# Altium schematic sheet Remote_Control.SchDoc
size A3; CheckedBy: <审核日期>; Author: llm; CompanyName: 孔乙己图书店; DocumentNumber: 1; SheetNumber: 1; SheetTotal: 1; PageSetup: Record=PageOptions|CenterHorizontal=True|CenterVertical=True|PrintScale=1.00|XCorrection=1.00|YCorrection=1.00|PrintKind=0|BorderSize=5000000|LeftOffset=0|BottomOffset=0|Orientation=2|PaperLength=1000|PaperWidth=1000|Scale=100|PaperSource=7|PrintQuality=600|MediaType=1|DitherType=10|PaperKind=A4|PrintScaleMode=1; DesignDate: <设计日期>; CheckDate: <审核人员>; SheetName: Remote_Control; SheetVersion: Rev.A; SheetDescription: <图纸描述>; productName: 遥控器
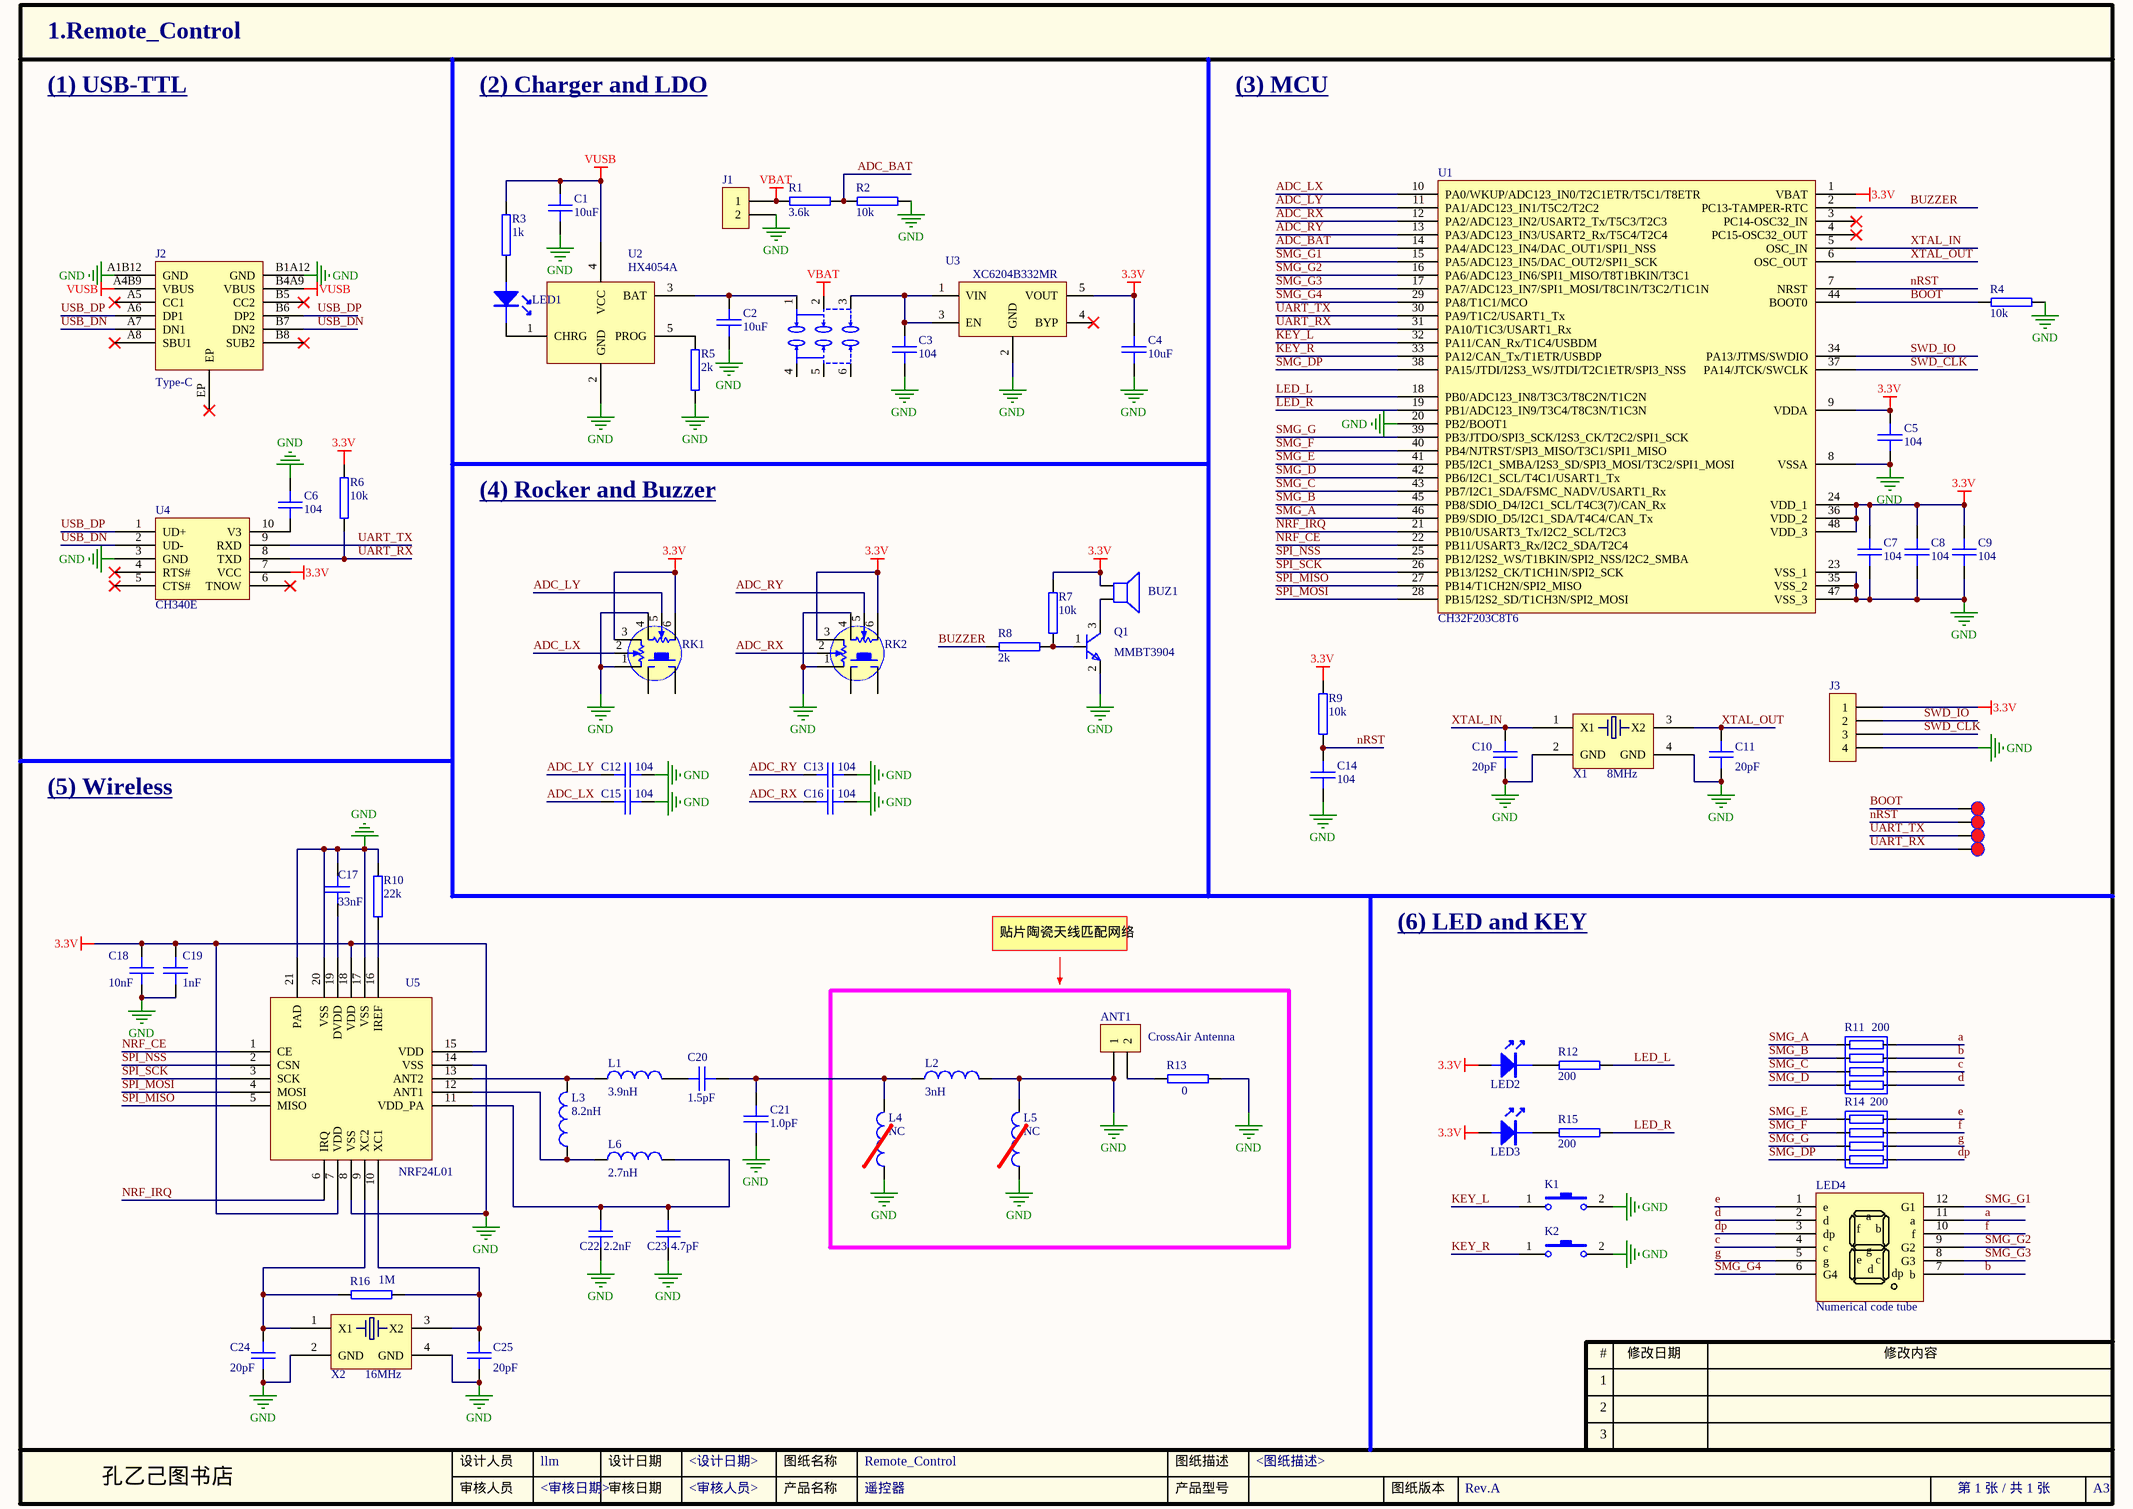
[diagram p0: Remote_Control.SchDoc]

## Parts
ANT1  CrossAir Antenna  [ANT-SMD_L3.1-W1.6]
BOOT  BOOT  [PAD-40]  (value not drawn)  (no BOM)
BUZ1  BUZZER  [BUZ-TH_BD9.6-P5.00-D0.7-FD]  (value not drawn)
C1  10uF  [0805C]
C2  10uF  [0805C]
C3  104  [0402C]
C4  10uF  [0805C]
C5  104  [0402C]
C6  104  [0402C]
C7  104  [0402C]
C8  104  [0402C]
C9  104  [0402C]
C10  20pF  [0402C]
C11  20pF  [0402C]
C12  104  [0402C]
C13  104  [0402C]
C14  104  [0402C]
C15  104  [0402C]
C16  104  [0402C]
C17  33nF  [0402C]
C18  10nF  [0402C]
C19  1nF  [0402C]
C20  1.5pF  [0402C]
C21  1.0pF  [0402C]
C22  2.2nF  [0402C]
C23  4.7pF  [0402C]
C24  20pF  [0402C]
C25  20pF  [0402C]
J1  CON2  [SIP-2-2.54]  (value not drawn)
J2  Type-C  [USB-C-SMD_TYPE-C-16P-1]
J3  CON4  [SIP-4-2.54]  (value not drawn)
K1  BUTTON  [KEY-TH_4P-L7.5-W6.8-P4.50-LS7.2]  (value not drawn)
K2  BUTTON  [KEY-TH_4P-L7.5-W6.8-P4.50-LS7.2]  (value not drawn)
L1  3.9nH  [0402R]
L2  3nH  [0402R]
L3  8.2nH  [0402R]
L4  NC  [0402R]
L5  NC  [0402R]
L6  2.7nH  [0402R]
LED1  Red  [LED-0603]  (value not drawn)
LED2  Blue  [LED-0603]  (value not drawn)
LED3  Blue  [LED-0603]  (value not drawn)
LED4  Numerical code tube  [0.28寸四位共阴数码管]
Q1  MMBT3904  [SOT-23]
R1  3.6k  [0402R]
R2  10k  [0402R]
R3  1k  [0402R]
R4  10k  [0402R]
R5  2k  [0402R]
R6  10k  [0402R]
R7  10k  [0402R]
R8  2k  [0402R]
R9  10k  [0402R]
R10  22k  [0402R]
R11  200  [RES-0603-8P]
R12  200  [0402R]
R13  0  [0402R]
R14  200  [RES-0603-8P]
R15  200  [0402R]
R16  1M  [0402R]
RK1  ROCKER  [ROCKER]  (value not drawn)
RK2  ROCKER  [ROCKER]  (value not drawn)
RST  RST  [PAD-40]  (value not drawn)  (no BOM)
Rx  Rx  [PAD-40]  (value not drawn)  (no BOM)
SW1  MST22D18G2  [SW-SMD_MST22D18G2]  (value not drawn)
Tx  Tx  [PAD-40]  (value not drawn)  (no BOM)
U1  CH32F203C8T6  [LQFP-48_7x7]
U2  HX4054A  [SOT-23-5_L3.0-W1.7-P0.95-LS2.8-BR]
U3  XC6204B332MR  [SOT-23-5]
U4  CH340E  [MSOP-10_L3.0-W3.0-P0.50-LS5.0-BL]
U5  NRF24L01  [QFN-20_L4.0-W4.0-P0.50-BL-EP]
X1  8MHz  [OSCCC250X320X80-4N]
X2  16MHz  [OSCCC250X320X80-4N]

## Nets
3.3V: BUZ1.1(+) C4.1 C5.2 C7.2 C8.2 C9.2 C18.1 C19.1 J3.1 LED2.1 LED3.1 R6.2 R7.2 R9.2 RK1.3 RK1.6 RK2.3 RK2.6 U1.1(VBAT) U1.9(VDDA) U1.24(VDD_1) U1.36(VDD_2) U1.48(VDD_3) U3.5(VOUT) U4.7(VCC) U5.7(VDD) U5.15(VDD) U5.18(VDD)
GND: ANT1.1 C1.2 C2.2 C3.2 C4.2 C5.1 C6.2 C7.1 C8.1 C9.1 C10.1 C11.1 C12.1 C13.1 C14.1 C15.1 C16.1 C17.1 C18.2 C19.2 C21.1 C22.2 C23.2 C24.1 C25.1 J1.2 J2.A1B12(GND) J2.B1A12(GND) J3.4 K1.2 K2.2 L2.2 L4.1 L5.1 L5.2 Q1.2(E) R2.1 R4.2 R5.1 R10.1 R13.2 RK1.1 RK1.4 RK2.1 RK2.4 U1.8(VSSA) U1.20(PB2/BOOT1) U1.23(VSS_1) U1.35(VSS_2) U1.47(VSS_3) U2.2(GND) U3.2(GND) U4.3(GND) U5.8(VSS) U5.14(VSS) U5.17(VSS) U5.20(VSS) U5.21(PAD) X1.2(GND) X1.4(GND) X2.2(GND) X2.4(GND)
VBAT: J1.1 R1.2 SW1.2
VUSB: C1.1 J2.A4B9(VBUS) J2.B4A9(VBUS) R3.2 U2.4(VCC)
a: LED4.11(a) R11.4
ADC_BAT: R1.1 R2.2 U1.14(PA4/ADC123_IN4/DAC_OUT1/SPI1_NSS)
ADC_LX: C15.2 RK1.2 U1.10(PA0/WKUP/ADC123_IN0/T2C1ETR/T5C1/T8ETR)
ADC_LY: C12.2 RK1.5 U1.11(PA1/ADC123_IN1/T5C2/T2C2)
ADC_RX: C16.2 RK2.2 U1.12(PA2/ADC123_IN2/USART2_Tx/T5C3/T2C3)
ADC_RY: C13.2 RK2.5 U1.13(PA3/ADC123_IN3/USART2_Rx/T5C4/T2C4)
b: LED4.7(b) R11.3
BOOT: BOOT.1 R4.1 U1.44(BOOT0)
BUZZER: R8.2 U1.2(PC13-TAMPER-RTC)
c: LED4.4(c) R11.2
d: LED4.2(d) R11.1
dp: LED4.3(dp) R14.1
e: LED4.1(e) R14.4
f: LED4.10(f) R14.3
g: LED4.5(g) R14.2
KEY_L: K1.1 U1.32(PA11/CAN_Rx/T1C4/USBDM)
KEY_R: K2.1 U1.33(PA12/CAN_Tx/T1ETR/USBDP)
LED_L: R12.1 U1.18(PB0/ADC123_IN8/T3C3/T8C2N/T1C2N)
LED_R: R15.1 U1.19(PB1/ADC123_IN9/T3C4/T8C3N/T1C3N)
NRF_CE: U1.22(PB11/USART3_Rx/I2C2_SDA/T2C4) U5.1(CE)
NRF_IRQ: U1.21(PB10/USART3_Tx/I2C2_SCL/T2C3) U5.6(IRQ)
nRST: C14.2 R9.1 RST.1 U1.7(NRST)
SMG_A: R11.5 U1.46(PB9/SDIO_D5/I2C1_SDA/T4C4/CAN_Tx)
SMG_B: R11.6 U1.45(PB8/SDIO_D4/I2C1_SCL/T4C3(7)/CAN_Rx)
SMG_C: R11.7 U1.43(PB7/I2C1_SDA/FSMC_NADV/USART1_Rx)
SMG_D: R11.8 U1.42(PB6/I2C1_SCL/T4C1/USART1_Tx)
SMG_DP: R14.8 U1.38(PA15/JTDI/I2S3_WS/JTDI/T2C1ETR/SPI3_NSS)
SMG_E: R14.5 U1.41(PB5/I2C1_SMBA/I2S3_SD/SPI3_MOSI/T3C2/SPI1_MOSI)
SMG_F: R14.6 U1.40(PB4/NJTRST/SPI3_MISO/T3C1/SPI1_MISO)
SMG_G: R14.7 U1.39(PB3/JTDO/SPI3_SCK/I2S3_CK/T2C2/SPI1_SCK)
SMG_G1: LED4.12(G1) U1.15(PA5/ADC123_IN5/DAC_OUT2/SPI1_SCK)
SMG_G2: LED4.9(G2) U1.16(PA6/ADC123_IN6/SPI1_MISO/T8T1BKIN/T3C1)
SMG_G3: LED4.8(G3) U1.17(PA7/ADC123_IN7/SPI1_MOSI/T8C1N/T3C2/T1C1N)
SMG_G4: LED4.6(G4) U1.29(PA8/T1C1/MCO)
SPI_MISO: U1.27(PB14/T1CH2N/SPI2_MISO) U5.5(MISO)
SPI_MOSI: U1.28(PB15/I2S2_SD/T1CH3N/SPI2_MOSI) U5.4(MOSI)
SPI_NSS: U1.25(PB12/I2S2_WS/T1BKIN/SPI2_NSS/I2C2_SMBA) U5.2(CSN)
SPI_SCK: U1.26(PB13/I2S2_CK/T1CH1N/SPI2_SCK) U5.3(SCK)
SWD_CLK: J3.3 U1.37(PA14/JTCK/SWCLK)
SWD_IO: J3.2 U1.34(PA13/JTMS/SWDIO)
UART_RX: R6.1 Rx.1 U1.31(PA10/T1C3/USART1_Rx) U4.8(TXD)
UART_TX: Tx.1 U1.30(PA9/T1C2/USART1_Tx) U4.9(RXD)
USB_DN: J2.A7(DN1) J2.B7(DN2) U4.2(UD-)
USB_DP: J2.A6(DP1) J2.B6(DP2) U4.1(UD+)
XTAL_IN: C10.2 U1.5(OSC_IN) X1.1(X1)
XTAL_OUT: C11.2 U1.6(OSC_OUT) X1.3(X2)
NetANT1_2: ANT1.2 R13.1
NetBUZ1_2: BUZ1.2(-) Q1.3(C)
NetC2_1: C2.1 SW1.1 U2.3(BAT)
NetC3_1: C3.1 SW1.3 U3.1(VIN) U3.3(EN)
NetC6_1: C6.1 U4.10(V3)
NetC17_2: C17.2 U5.19(DVDD)
NetC20_1: C20.1 L1.2
NetC20_2: C20.2 C21.2 L2.1 L4.2
NetC22_1: C22.1 C23.1 L6.2 U5.11(VDD_PA)
NetC24_2: C24.2 R16.1 U5.9(XC2) X2.1(X1)
NetC25_2: C25.2 R16.2 U5.10(XC1) X2.3(X2)
NetL1_1: L1.1 L3.2 U5.13(ANT2)
NetL3_1: L3.1 L6.1 U5.12(ANT1)
NetLED1_1: LED1.1 R3.1
NetLED1_2: LED1.2 U2.1(CHRG)
NetLED2_2: LED2.2 R12.2
NetLED3_2: LED3.2 R15.2
NetQ1_1: Q1.1(B) R7.1 R8.1
NetR5_2: R5.2 U2.5(PROG)
NetR10_2: R10.2 U5.16(IREF)

Not connected (* = marked no-connect by the designer): J2 A5(CC1)* A8(SBU1)* B5(CC2)* B8(SUB2)* EP*; RK1 J1 J2; RK2 J1 J2; SW1 4 5 6; U1 3(PC14-OSC32_IN)* 4(PC15-OSC32_OUT)*; U3 4(BYP)*; U4 4(RTS#)* 5(CTS#)* 6(TNOW)*

## Notes on the sheet
- (1) USB-TTL
- (2) Charger and LDO
- (3) MCU
- (4) Rocker and Buzzer
- (5) Wireless
- 贴片陶瓷天线匹配网络
- (6) LED and KEY
- 1
- #
- 修改日期
- 修改内容
- 2
- 3
- 设计人员
- 审核人员
- 设计日期
- 审核日期
- 产品名称
- 图纸名称
- 产品型号
- 图纸描述
- 图纸版本
- A3

## Library data of the parts
ANT1 J1 = CON2: Connector
BOOT RST Rx Tx = TEST-DOT: 测试点
BUZ1 = BUZZER: 蜂鸣器
C1-C25 = CAP: 电容
J3 = CON4: Connector
K1 K2 = BUTTON: 按键开关
L1-L6 = INDUCTOR_1: 电感
LED1-LED3 = LED: 发光二极管; Value: 0603Red,SMD
LED4 = Numerical code tube: 四位共阴数码管
Q1 = NPN: NPN三极管
R1-R10 R12 R13 R15 R16 = RES: 电阻
R11 R14 = RES_4: 排阻
RK1 RK2 = ROCKER: 摇杆电位器
SW1 = MST22D18G2: 六脚拨动开关; Manufacturer: SHOU HAN(首韩); Add into BOM: yes; Name: MST22D18G2; Symbol: MST22D18G2; Device: MST22D18G2; LCSC Part Name: 两档立式贴片 6脚拨动 柄长2.0MM; Supplier Part: C431544; Manufacturer Part: MST22D18G2; Supplier Footprint: SMD,3.6x9.1mm; JLCPCB Part Class: Extended Part; Datasheet: https://atta.szlcsc.com/upload/public/pdf/source/20190925/C431544_D32DFFD935A96A6C5145903882D4ABA1.pdf; Supplier: LCSC; Convert to PCB: yes
U1 = STM32F103C: STM32单片机48引脚
U2 = HX4054A: 锂电池充电芯片
U3 = ZL6205A30TS5: LDO, 3.0V输出
U4 = CH340E: USB-TTL芯片
U5 = NRF24L01: 2.4G无线通信芯片
X1 X2 = XTAL4: 4pin贴片无源晶振